# EAGLE design lcd_driver (EAGLE 5.06)
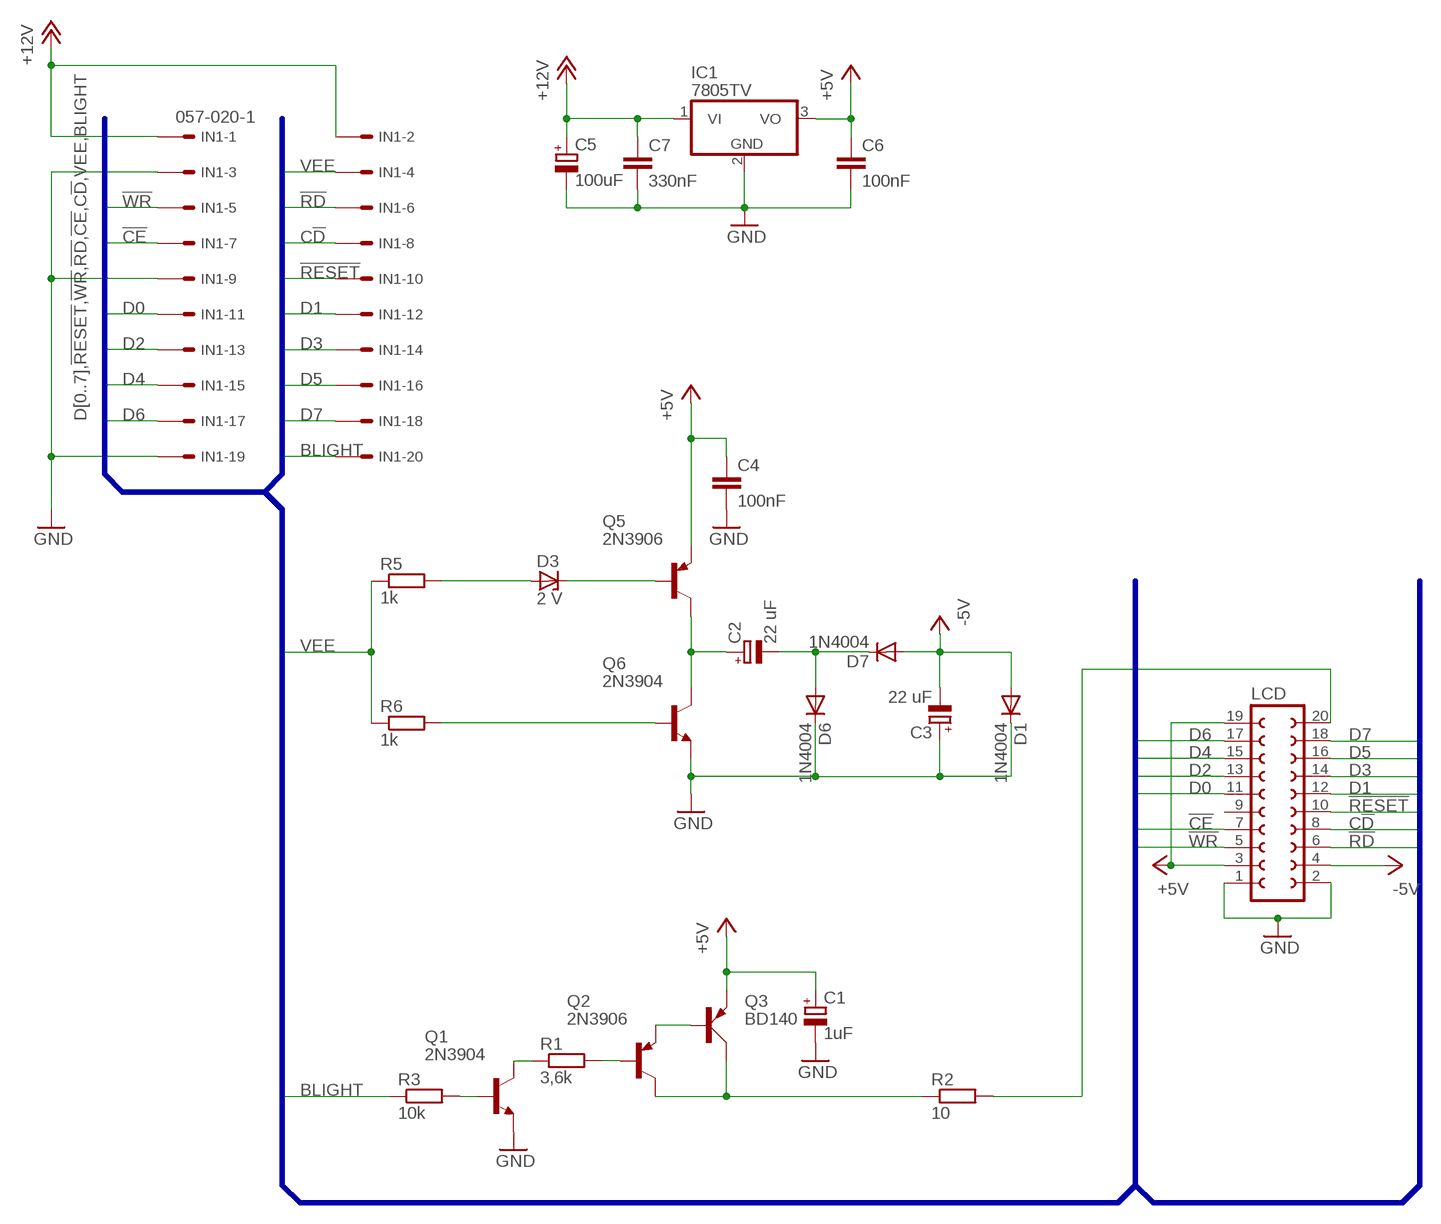
[diagram p0: schematic, sheet 1]

## Parts
C1  1uF  CPOL-EUE1.8-4  [E1,8-4]
C2  22 uF  CPOL-EUE2.5-7  [E2,5-7]
C3  22 uF  CPOL-EUE2.5-7  [E2,5-7]
C4  100nF  C-EU050-025X075  [C050-025X075]
C5  100uF  CPOL-EUE3.5-8  [E3,5-8]
C6  100nF  C-EU050-025X075  [C050-025X075]
C7  330nF  C-EU050-025X075  [C050-025X075]
D1  1N4004  [DO41-10]
D3  2 V  ZENER-DIODEDO34-7  [DO34Z7]
D6  1N4004  [DO41-10]
D7  1N4004  [DO41-10]
IC1  7805TV  [TO220V]
IN1  057-020-1  [057-020-1]
LCD  FE10-2  [FE10-2]
Q1  2N3904  [TO92]
Q2  2N3906  [TO92]
Q3  BD140  [TO126AV]
Q5  2N3906  [TO92]
Q6  2N3904  [TO92]
R1  3,6k  R-EU_0204/7  [0204/7]
R2  10  R-EU_0414/15  [0414/15]
R3  10k  R-EU_0204/7  [0204/7]
R5  1k  R-EU_0204/7  [0204/7]
R6  1k  R-EU_0204/7  [0204/7]

## Nets
!CE: IN1.7 LCD.7
!RD: IN1.6 LCD.6
!RESET: IN1.10 LCD.10
!WR: IN1.5 LCD.5
+5V: C1.+ C4.1 C6.1 IC1.3(VO) LCD.3 LCD.19 Q3.E Q5.3(E)
+12V: C5.+ C7.1 IC1.1(VI) IN1.1 IN1.2
-5V: C3.- D1.A D7.A LCD.4
BLIGHT: IN1.20 Q1.1(C) R1.1 R3.1
C!D: IN1.8 LCD.8
D0: IN1.11 LCD.11
D1: IN1.12 LCD.12
D2: IN1.13 LCD.13
D3: IN1.14 LCD.14
D4: IN1.15 LCD.15
D5: IN1.16 LCD.16
D6: IN1.17 LCD.17
D7: IN1.18 LCD.18
GND: C1.- C4.2 C5.- C6.2 C7.2 IC1.2(GND) IN1.3 IN1.9 IN1.19 LCD.1 LCD.2 Q1.3(E) Q6.3(E)
N$1: Q2.1(C) Q3.C R2.1
N$2: Q1.2(B) R3.2
N$3: Q2.3(E) Q3.B
N$4: LCD.20 R2.2
N$5: Q2.2(B) R1.2
N$6: C2.+ Q5.1(C) Q6.1(C)
N$7: D3.C Q5.2(B)
N$12: D3.A R5.2
N$13: Q6.2(B) R6.2
N$15: C2.- D6.A D7.C
N$17: C3.+ D1.C D6.C
VEE: IN1.4 R5.1 R6.1
Unconnected: LCD.9

## Buses
D[0..7],!RESET,!WR,!RD,!CE,C!D,VEE,BLIGHT

## Library data of the parts
C1 C5 = resistor:CPOL-EU: POLARIZED CAPACITOR, European symbol
C2 C3 = rcl:CPOL-EU: POLARIZED CAPACITOR, European symbol
C4 C6 C7 = resistor:C-EU: CAPACITOR, European symbol
D1 D6 D7 = diode:1N4004: DIODE general purpose rectifier, 1 A
D3 = diode:ZENER-DIODE: Z-Diode
IC1 = linear:78*: Positive VOLTAGE REGULATOR Source: http://cache.national.com/ds/LM/LM78L05.pdf http://www.fairchildsemi.com/ds/LM/LM7805.pdf
IN1 = con-panduit:057-020-: CONNECTOR 20-pin series 057 contact pc board low profile headers
LCD = con-lsta:FE10-2: FEMALE HEADER
Q1 Q6 = transistor-npn:2N3904: NPN Transistor
Q2 Q5 = transistor-pnp:2N3906: PNP Transistor
Q3 = transistor-power:BD140: PNP TRANSISTOR
R1-R3 R5 R6 = resistor:R-EU_: RESISTOR, European symbol

## Board
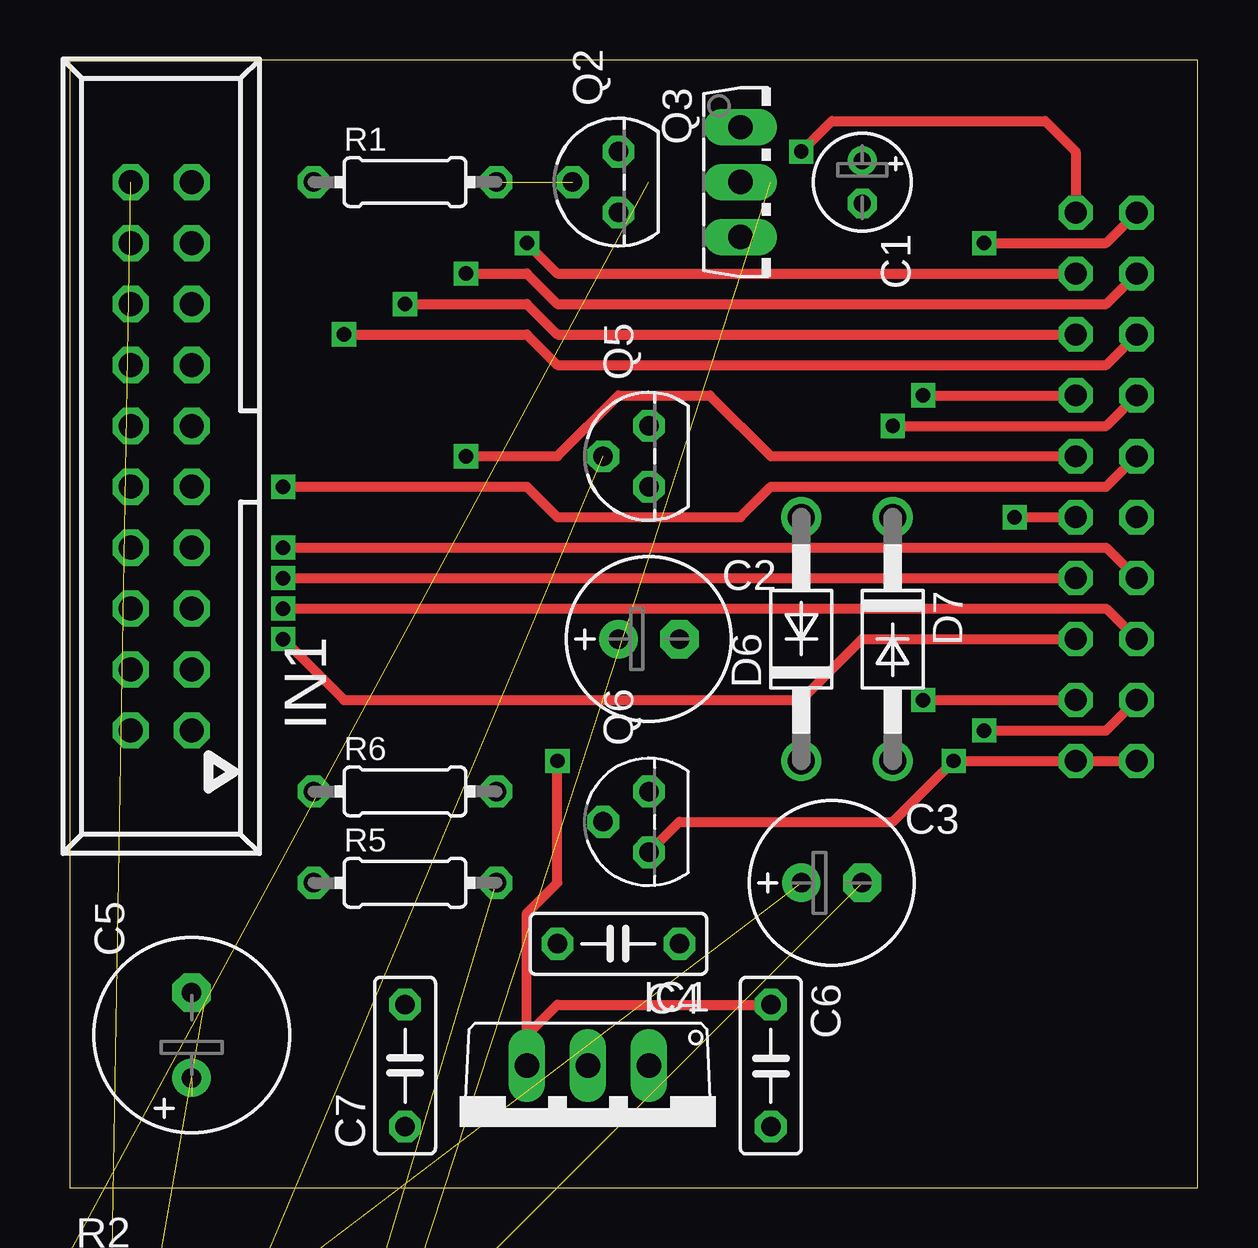
[diagram p1: board, top side]
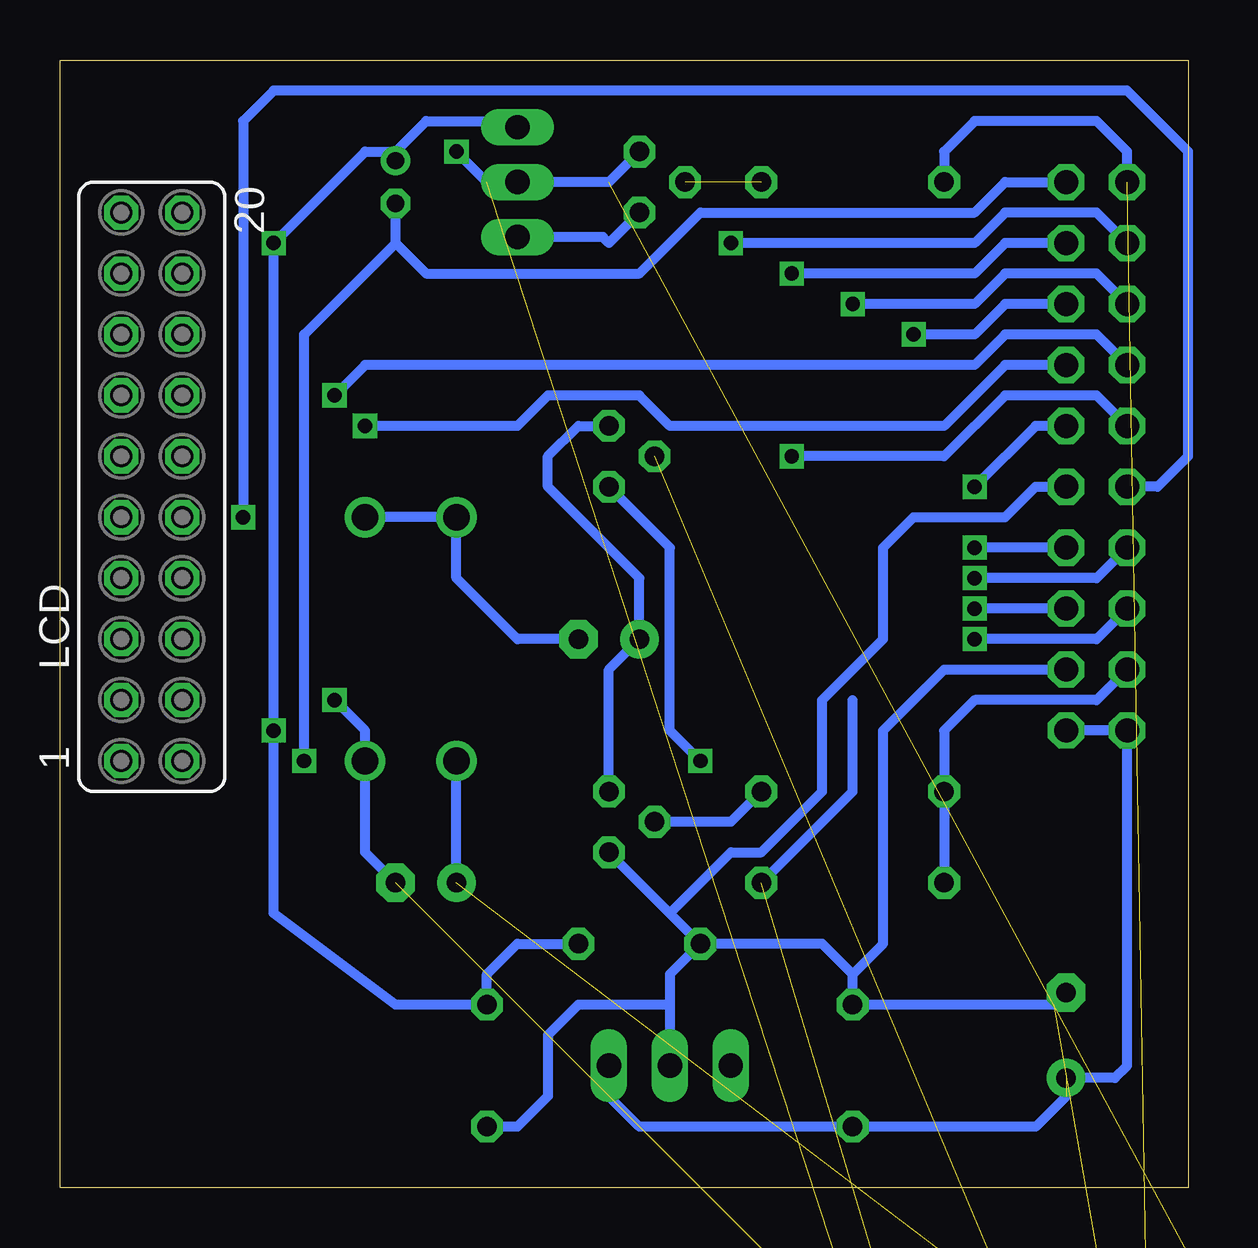
[diagram p2: board, bottom side, seen from below]

Size 47 x 47 mm. Coordinates in mm from the lower left corner, seen from the top.
Outline: 0,0 47,0 47,47 0,47 0,0
Copper layers (1*16): Top 0.035mm / dielectric 1.5mm / Bottom 0.035mm
Design rules "default": minimum track width 10mil, minimum drill 24mil, track to track 8mil, track to pad 8mil, pad to pad 8mil, via to via 8mil, smd to smd 8mil, copper to edge 40mil, drill to drill 8mil, minimum pad ring 10mil, minimum via ring 8mil, stop-mask expansion 4mil, vias tented up to drill 0mil, thermal gap 10mil

### Footprints (pad centres in the part's own frame; a part is rotated, then mirrored left to right if it is on the bottom)
E1,8-4 = drill 0.711 pad 1.168 round: + -0.889,0 | drill 0.711 pad 1.168 octagon: - 0.889,0
E2,5-7 = drill 0.813 pad 1.6 round: + -1.27,0 | drill 0.813 pad 1.6 octagon: - 1.27,0
C050-025X075 = drill 0.813 octagon: 1 -2.54,0; 2 2.54,0
E3,5-8 = drill 0.813 pad 1.6 round: + -1.778,0 | drill 0.813 pad 1.6 octagon: - 1.778,0
DO41-10 = drill 1.118 round: A 5.08,0; C -5.08,0
DO34Z7 = drill 0.813 long: A 3.81,0; C -3.81,0
TO220V = drill 1.016 long: 1 -2.54,-2.54; 2 0,-2.54; 3 2.54,-2.54
057-020-1 = drill 1 octagon: 1 -11.43,-1.27; 2 -11.43,1.27; 3 -8.89,-1.27; 4 -8.89,1.27; 5 -6.35,-1.27; 6 -6.35,1.27; 7 -3.81,-1.27; 8 -3.81,1.27; 9 -1.27,-1.27; 10 -1.27,1.27; 11 1.27,-1.27; 12 1.27,1.27; 13 3.81,-1.27; 14 3.81,1.27; 15 6.35,-1.27; 16 6.35,1.27; 17 8.89,-1.27; 18 8.89,1.27; 19 11.43,-1.27; 20 11.43,1.27
FE10-2 = drill 0.914 octagon: 1 -11.43,1.27; 2 -11.43,-1.27; 3 -8.89,1.27; 4 -8.89,-1.27; 5 -6.35,1.27; 6 -6.35,-1.27; 7 -3.81,1.27; 8 -3.81,-1.27; 9 -1.27,1.27; 10 -1.27,-1.27; 11 1.27,1.27; 12 1.27,-1.27; 13 3.81,1.27; 14 3.81,-1.27; 15 6.35,1.27; 16 6.35,-1.27; 17 8.89,1.27; 18 8.89,-1.27; 19 11.43,1.27; 20 11.43,-1.27
TO92 = drill 0.813 octagon: 1 1.27,0; 2 0,1.905; 3 -1.27,0
TO126AV = drill 1.016 long: B 2.286,-1.27; C 0,-1.27; E -2.286,-1.27
0204/7 = drill 0.813 octagon: 1 -3.81,0; 2 3.81,0
0414/15 = drill 1.016 octagon: 1 -7.62,0; 2 7.62,0

### Placement (x,y rotation side)
C1  33.02,41.91 270 top
C2  24.13,22.86 0 top
C3  31.75,12.7 0 top
C4  22.86,10.16 180 top
C5  5.08,6.35 90 top
C6  29.21,5.08 270 top
C7  13.97,5.08 90 top
D1  3.81,-11.43 0 top  (outside the outline)
D3  2.54,-25.4 0 top  (outside the outline)
D6  30.48,22.86 90 top
D7  34.29,22.86 270 top
IC1  21.59,2.54 180 top
IN1  3.81,30.48 90 top
LCD  43.18,29.21 90 bottom
Q1  0,-31.75 0 top  (outside the outline)
Q2  22.86,41.91 90 top
Q3  29.21,41.91 270 top
Q5  24.13,30.48 90 top
Q6  24.13,15.24 90 top
R1  13.97,41.91 0 top
R2  6.35,-5.08 0 top  (outside the outline)
R3  1.27,-38.1 0 top  (outside the outline)
R5  13.97,12.7 0 top
R6  13.97,16.51 0 top

### Tracks (layer width: path | path; a pad name or v marks a point on that pad's centre or on a via)
!CE  (via drill 0.6)
  Top 0.406: v8.89,26.67 43.18,26.67 LCD.7
  Bottom 0.406: IN1.7 v8.89,26.67
!RD  (via drill 0.6)
  Top 0.406: v8.89,22.86 11.43,20.32 30.48,20.32 33.02,22.86 LCD.6
  Bottom 0.406: IN1.6 3.81,22.86 v8.89,22.86
!RESET  (via drill 0.6)
  Top 0.406: v39.37,27.94 LCD.10
  Bottom 0.406: IN1.10 1.27,29.21 0,30.48 0,43.18 2.54,45.72 38.1,45.72 39.37,44.45 v39.37,27.94
!WR  (via drill 0.6)
  Top 0.406: v8.89,24.13 43.18,24.13 LCD.5
  Bottom 0.406: IN1.5 v8.89,24.13
+5V  (via drill 0.6)
  Top 0.406: LCD.3 43.18,19.05 v38.1,19.05 | v38.1,39.37 43.18,39.37 LCD.19 | C6.1 20.32,7.62 19.05,6.35 IC1.3 19.05,11.43 20.32,12.7 v20.32,17.78
  Bottom 0.406: 33.02,43.18 31.75,44.45 28.19,44.45 Q3.E | C4.1 27.94,10.16 29.21,8.89 C6.1 33.02,7.62 38.1,11.43 v38.1,19.05 v38.1,39.37 34.29,43.18 33.02,43.18 | 33.02,43.18 C1.+ | Q5.3 21.59,26.67 21.59,19.05 v20.32,17.78
+12V  (1 unrouted)
  Bottom 0.406: 5.08,3.81 6.35,2.54 C7.1 22.86,2.54 24.13,3.81 IC1.1 | IN1.1 IN1.2 2.54,5.08 3.05,4.57 C5.+
-5V  (via drill 0.6)  (1 unrouted)
  Top 0.406: v35.56,20.32 LCD.4
  Bottom 0.406: C3.- 34.29,13.97 D7.A 34.29,19.05 v35.56,20.32
BLIGHT  (2 unrouted)
  Bottom 0.406: IN1.20 2.54,43.18 3.81,44.45 8.89,44.45 10.16,43.18 R1.1
C!D  (via drill 0.6)
  Top 0.406: v8.89,25.4 LCD.8
  Bottom 0.406: IN1.8 3.81,25.4 v8.89,25.4
D0  (via drill 0.6)
  Top 0.406: v8.89,29.21 19.05,29.21 20.32,27.94 27.94,27.94 29.21,29.21 43.18,29.21 LCD.11
  Bottom 0.406: IN1.11 6.35,31.75 v8.89,29.21
D1  (via drill 0.6)
  Top 0.406: v16.51,30.48 20.32,30.48 22.86,33.02 26.67,33.02 29.21,30.48 LCD.12
  Bottom 0.406: IN1.12 3.81,33.02 7.62,33.02 10.16,30.48 v16.51,30.48
D2  (via drill 0.6)
  Top 0.406: v34.29,31.75 43.18,31.75 LCD.13
  Bottom 0.406: IN1.13 7.62,34.29 10.16,31.75 21.59,31.75 22.86,33.02 26.67,33.02 27.94,31.75 v34.29,31.75
D3  (via drill 0.6)
  Top 0.406: v35.56,33.02 LCD.14
  Bottom 0.406: IN1.14 3.81,35.56 7.62,35.56 8.89,34.29 34.29,34.29 v35.56,33.02
D4  (via drill 0.6)
  Top 0.406: v11.43,35.56 19.05,35.56 20.32,34.29 43.18,34.29 LCD.15
  Bottom 0.406: IN1.15 7.62,36.83 8.89,35.56 v11.43,35.56
D5  (via drill 0.6)
  Top 0.406: v13.97,36.83 19.05,36.83 20.32,35.56 LCD.16
  Bottom 0.406: IN1.16 3.81,38.1 7.62,38.1 8.89,36.83 v13.97,36.83
D6  (via drill 0.6)
  Top 0.406: v16.51,38.1 19.05,38.1 20.32,36.83 43.18,36.83 LCD.17
  Bottom 0.406: IN1.17 7.62,39.37 8.89,38.1 v16.51,38.1
D7  (via drill 0.6)
  Top 0.406: LCD.18 20.32,38.1 v19.05,39.37
  Bottom 0.406: v19.05,39.37 8.89,39.37 7.62,40.64 3.81,40.64 IN1.18
GND  (via drill 0.6)  (1 unrouted)
  Top 0.406: LCD.1 LCD.2 v36.83,17.78 34.29,15.24 25.4,15.24 Q6.3
  Bottom 0.406: C5.- 5.59,7.62 C7.2 13.97,8.89 | C4.2 15.24,10.16 13.97,8.89 | 21.59,7.62 21.59,8.89 C4.2 | 21.59,7.62 IC1.2 | C6.2 27.94,2.54 26.67,3.81 26.67,6.35 25.4,7.62 21.59,7.62 | C4.2 21.59,11.43 | 21.59,11.43 Q6.3 | IN1.3 10.16,21.59 12.7,19.05 12.7,10.16 13.97,8.89 | v36.83,17.78 36.83,35.56 33.02,39.37 | IN1.9 6.35,29.21 7.62,27.94 11.43,27.94 12.7,26.67 12.7,22.86 15.24,20.32 15.24,16.51 17.78,13.97 19.05,13.97 21.59,11.43 | IN1.19 7.62,41.91 8.89,40.64 20.32,40.64 22.86,38.1 31.75,38.1 33.02,39.37 | 33.02,39.37 C1.-
N$1  (1 unrouted)
  Bottom 0.406: Q3.C 24.13,41.91 Q2.1
N$2  (1 unrouted)
N$3
  Bottom 0.406: Q3.B 24.38,39.62 24.13,39.37 Q2.3
N$4  (via drill 0.6)  (1 unrouted)
  Top 0.406: v30.48,43.18 31.75,44.45 40.64,44.45 41.91,43.18 LCD.20
  Bottom 0.406: 29.21,41.91 v30.48,43.18
N$5  (1 unrouted)
N$6
  Bottom 0.406: Q5.1 25.4,31.75 26.67,30.48 26.67,29.21 22.86,25.4 C2.+ 24.13,21.59 Q6.1
N$7  (1 unrouted)
N$12  (1 unrouted)
  Bottom 0.406: R5.2 13.97,16.51 13.97,20.32
N$13
  Bottom 0.406: R6.2 19.05,15.24 Q6.2
N$15
  Bottom 0.406: C2.- 27.94,22.86 30.48,25.4 D6.A D7.C
N$17  (1 unrouted)
  Bottom 0.406: C3.+ D6.C
VEE
  Bottom 0.406: R5.1 R6.1 10.16,19.05 8.89,20.32 3.81,20.32 IN1.4